# Altium schematic sheet CAMERA_INTERFACE.SchDoc
size C; SheetNumber: 3; SheetTotal: 9
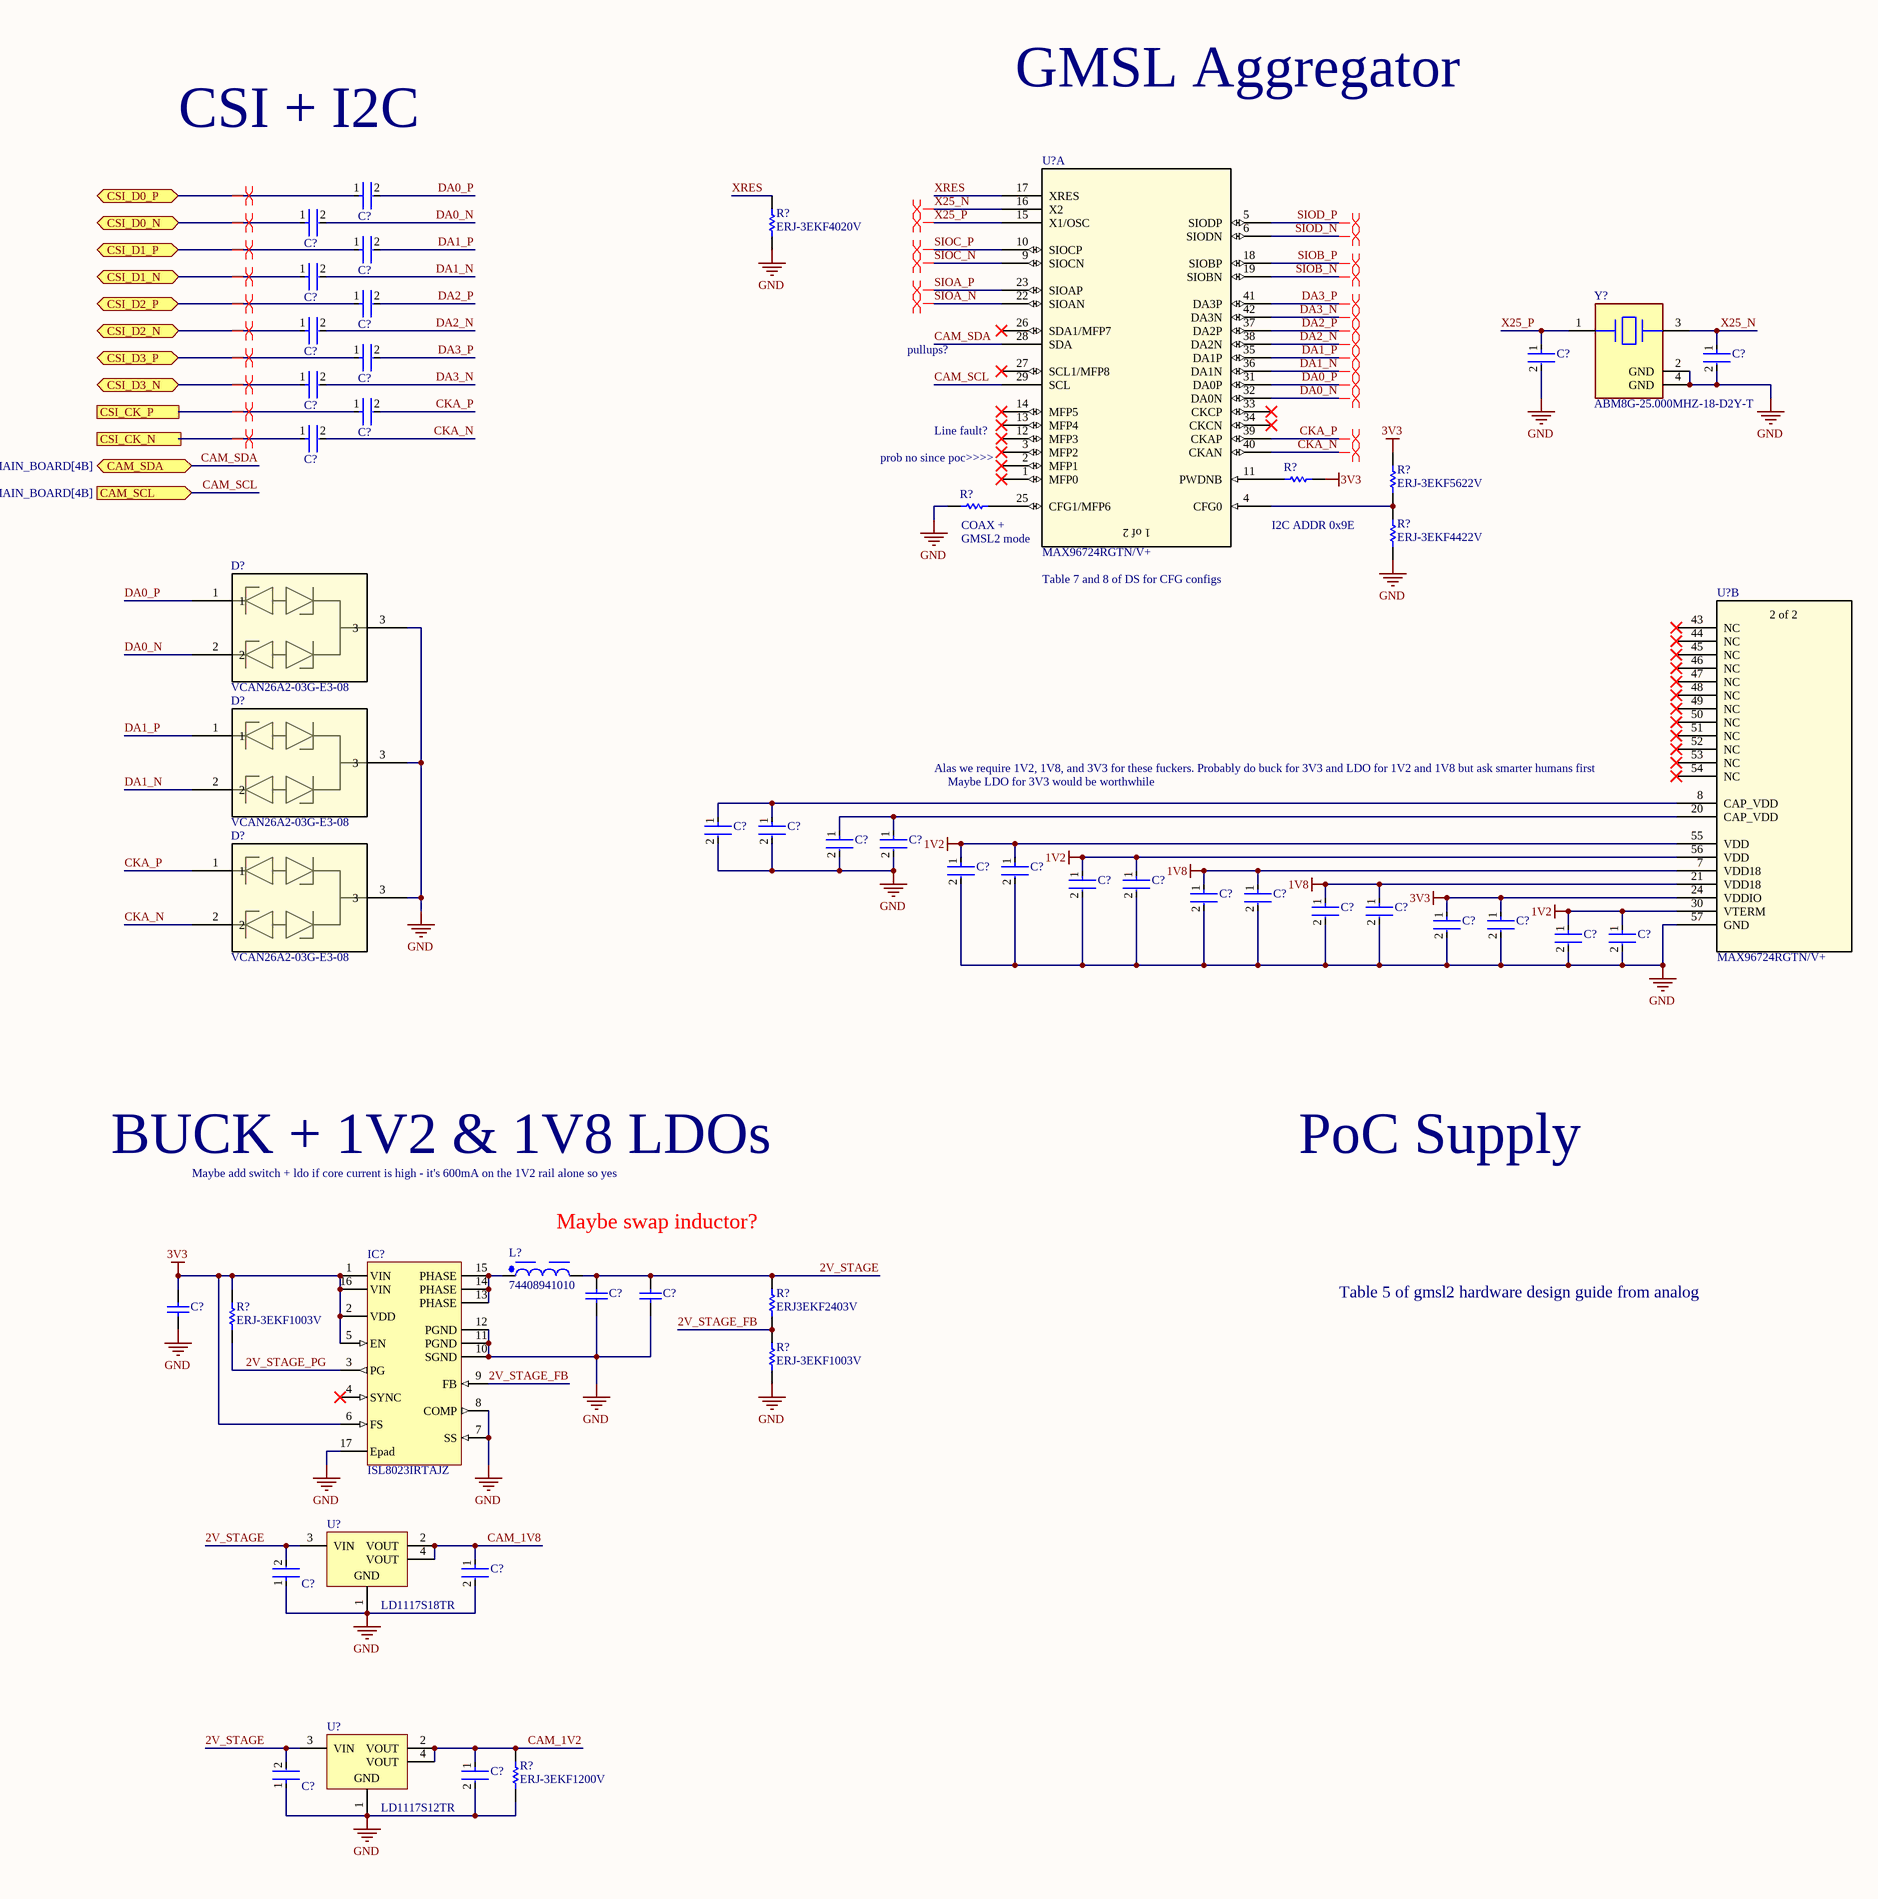
[diagram p0: CAMERA_INTERFACE.SchDoc, left]
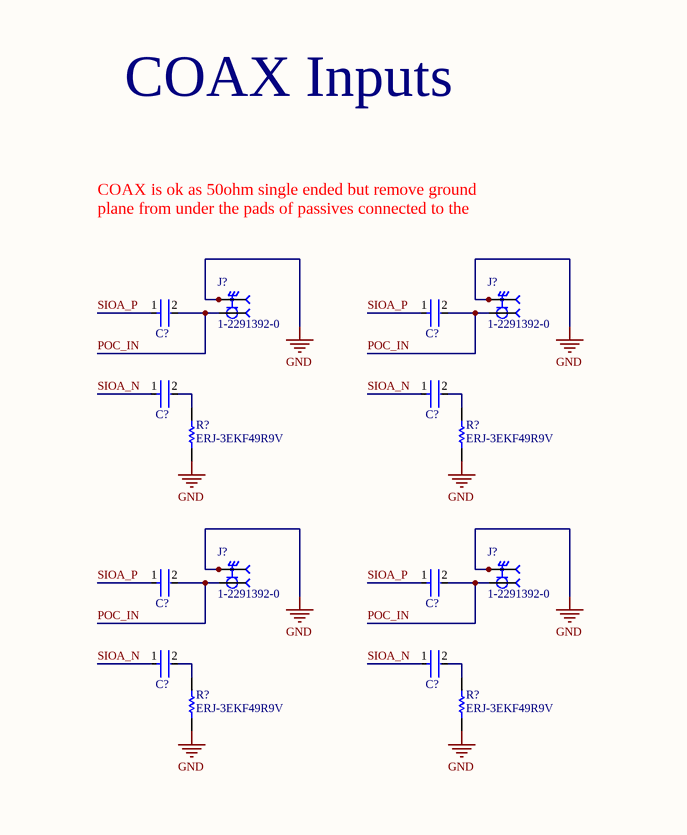
[diagram p1: CAMERA_INTERFACE.SchDoc, middle]

## Parts
(Parts that share a designator on the sheet are numbered #1, #2 ... from top to bottom, then left to right.)
C?#1  C1005X7R1H104K050BB  [FP-C1005-050-0_05-IPC_C]  (value not drawn)
C?#2  C1005X7R1H104K050BB  [FP-C1005-050-0_05-IPC_C]  (value not drawn)
C?#3  C1005X7R1H104K050BB  [FP-C1005-050-0_05-IPC_C]  (value not drawn)
C?#4  C1005X7R1H104K050BB  [FP-C1005-050-0_05-IPC_C]  (value not drawn)
C?#5  C1005X7R1H104K050BB  [FP-C1005-050-0_05-IPC_C]  (value not drawn)
C?#6  C1005X7R1H104K050BB  [FP-C1005-050-0_05-IPC_C]  (value not drawn)
C?#7  C1005X7R1H104K050BB  [FP-C1005-050-0_05-IPC_C]  (value not drawn)
C?#8  C1005X7R1H104K050BB  [FP-C1005-050-0_05-IPC_C]  (value not drawn)
C?#9  C0603C300J5GACTU  [FP-C0603C-CF-MFG]  (value not drawn)
C?#10  C0603C300J5GACTU  [FP-C0603C-CF-MFG]  (value not drawn)
C?#11  C1005X7R1H104K050BB  [FP-C1005-050-0_05-IPC_C]  (value not drawn)
C?#12  C1005X7R1H104K050BB  [FP-C1005-050-0_05-IPC_C]  (value not drawn)
C?#13  C1005X7R1H104K050BB  [FP-C1005-050-0_05-IPC_C]  (value not drawn)
C?#14  C1005X7R1H104K050BB  [FP-C1005-050-0_05-IPC_C]  (value not drawn)
C?#15  C1005X7R1H104K050BB  [FP-C1005-050-0_05-IPC_C]  (value not drawn)
C?#16  C1005X7R1H104K050BB  [FP-C1005-050-0_05-IPC_C]  (value not drawn)
C?#17  C1005X7R1H104K050BB  [FP-C1005-050-0_05-IPC_C]  (value not drawn)
C?#18  C1005X7R1H104K050BB  [FP-C1005-050-0_05-IPC_C]  (value not drawn)
C?#19  C1005X7R1H104K050BB  [FP-C1005-050-0_05-IPC_C]  (value not drawn)
C?#20  C1005X7R1H104K050BB  [FP-C1005-050-0_05-IPC_C]  (value not drawn)
C?#21  GRM188R60J106ME47D  [FP-GRM188-0_1-e0_2_0_55-IPC_A]  (value not drawn)
C?#22  CC0603KRX7R8BB103  [FP-CC0603-DA-MFG]  (value not drawn)
C?#23  GRM188R60J106ME47D  [FP-GRM188-0_1-e0_2_0_55-IPC_A]  (value not drawn)
C?#24  CC0603KRX7R8BB103  [FP-CC0603-DA-MFG]  (value not drawn)
C?#25  GRM188R60J106ME47D  [FP-GRM188-0_1-e0_2_0_55-IPC_A]  (value not drawn)
C?#26  CC0603KRX7R8BB103  [FP-CC0603-DA-MFG]  (value not drawn)
C?#27  GRM188R60J106ME47D  [FP-GRM188-0_1-e0_2_0_55-IPC_A]  (value not drawn)
C?#28  CC0603KRX7R8BB103  [FP-CC0603-DA-MFG]  (value not drawn)
C?#29  GRM188R60J106ME47D  [FP-GRM188-0_1-e0_2_0_55-IPC_A]  (value not drawn)
C?#30  CC0603KRX7R8BB103  [FP-CC0603-DA-MFG]  (value not drawn)
C?#31  GRM188R60J106ME47D  [FP-GRM188-0_1-e0_2_0_55-IPC_A]  (value not drawn)
C?#32  CC0603KRX7R8BB103  [FP-CC0603-DA-MFG]  (value not drawn)
C?#33  GRM188R60J106ME47D  [FP-GRM188-0_1-e0_2_0_55-IPC_A]  (value not drawn)
C?#34  CC0603KRX7R8BB103  [FP-CC0603-DA-MFG]  (value not drawn)
C?#35  GRM188R60J106ME47D  [FP-GRM188-0_1-e0_2_0_55-IPC_A]  (value not drawn)
C?#36  CC0603KRX7R8BB103  [FP-CC0603-DA-MFG]  (value not drawn)
C?#37  C1608X5R0J226M080AC  [CAPC1608X100X20ML10]  (value not drawn)
C?#38  C1608X5R0J226M080AC  [CAPC1608X100X20ML10]  (value not drawn)
C?#39  C1608X5R0J226M080AC  [CAPC1608X100X20ML10]  (value not drawn)
C?#40  GRM188R60J106ME47D  [FP-GRM188-0_1-e0_2_0_55-IPC_A]  (value not drawn)
C?#41  C1005X7R1H104K050BB  [FP-C1005-050-0_05-IPC_C]  (value not drawn)
C?#42  GRM188R60J106ME47D  [FP-GRM188-0_1-e0_2_0_55-IPC_A]  (value not drawn)
C?#43  C1005X7R1H104K050BB  [FP-C1005-050-0_05-IPC_C]  (value not drawn)
D?#1  VCAN26A2-03G-E3-08  [VCAN26A2-03G-E3-08-Footprint-1]
D?#2  VCAN26A2-03G-E3-08  [VCAN26A2-03G-E3-08-Footprint-1]
D?#3  VCAN26A2-03G-E3-08  [VCAN26A2-03G-E3-08-Footprint-1]
IC?  ISL8023IRTAJZ  [TQFN50P300X300X80_HS-17N]
J?#1  1-2291392-0  [1-2291392-0-Footprint-1]
J?#2  1-2291392-0  [1-2291392-0-Footprint-1]
J?#3  1-2291392-0  [1-2291392-0-Footprint-1]
J?#4  1-2291392-0  [1-2291392-0-Footprint-1]
L?  74408941010  [WE-SPC_4818]
R?#1  ERJ-3EKF4020V  [RESC1608X55X30LL15T15]
R?#2  ERJ-3EKF49R9V  [RESC1608X55X30ML15T15]
R?#3  ERJ-3EKF49R9V  [RESC1608X55X30ML15T15]
R?#4  ERJ3EKF1002V  [RESC1609X55X30LL15T15]  (value not drawn)
R?#5  ERJ-3EKF5622V  [RESC1608X55X30LL15T15]
R?#6  ERJ3EKF1002V  [RESC1609X55X30LL15T15]  (value not drawn)
R?#7  ERJ-3EKF4422V  [RESC1608X55X30ML15T15]
R?#8  ERJ-3EKF49R9V  [RESC1608X55X30ML15T15]
R?#9  ERJ-3EKF49R9V  [RESC1608X55X30ML15T15]
R?#10  ERJ3EKF2403V  [RESC1608X55X30NL15T15]
R?#11  ERJ-3EKF1003V  [RESC1608X55X30ML15T15]
R?#12  ERJ-3EKF1003V  [RESC1608X55X30ML15T15]
R?#13  ERJ-3EKF1200V  [RESC1609X55X30ML15T15]
U?#1  MAX96724RGTN/V+  [QFN50P800X800X80_HS-57N]  (part A of 2)
U?#2  MAX96724RGTN/V+  [QFN50P800X800X80_HS-57N]  (part B of 2)
U?#3  LD1117S18TR  [SOT-223_M]
U?#4  LD1117S12TR  [SOT-223_M]
Y?  ABM8G-25.000MHZ-18-D2Y-T  [FP-ABM8G-MFG]

## Ports
CAM_SCL (in, see MAIN_BOARD[4B]), CAM_SDA (bidir, see MAIN_BOARD[4B]), CSI_CK_N (in), CSI_CK_P (in), CSI_D0_N (bidir), CSI_D0_P (bidir), CSI_D1_N (bidir), CSI_D1_P (bidir), CSI_D2_N (bidir), CSI_D2_P (bidir), CSI_D3_N (bidir), CSI_D3_P (bidir)

## Nets
1V2: C?#25.1 C?#26.1 C?#27.1 C?#28.1 C?#35.1 C?#36.1 U?#2.30(VTERM) U?#2.55(VDD) U?#2.56(VDD)
1V8: C?#29.1 C?#30.1 C?#31.1 C?#32.1 U?#2.7(VDD18) U?#2.21(VDD18)
3V3: C?#33.1 C?#34.1 C?#39.2 IC?.1(VIN) IC?.2(VDD) IC?.5(EN) IC?.6(FS) IC?.16(VIN) R?#4.2 R?#5.2 R?#11.2 U?#2.24(VDDIO)
GND: C?#9.2 C?#10.2 C?#21.2 C?#22.2 C?#23.2 C?#24.2 C?#25.2 C?#26.2 C?#27.2 C?#28.2 C?#29.2 C?#30.2 C?#31.2 C?#32.2 C?#33.2 C?#34.2 C?#35.2 C?#36.2 C?#37.1 C?#38.1 C?#39.1 C?#40.2 C?#41.1 C?#42.2 C?#43.1 D?#1.3 D?#2.3 D?#3.3 IC?.7(SS) IC?.8(COMP) IC?.10(SGND) IC?.11(PGND) IC?.12(PGND) IC?.17(Epad) J?#1.S1 J?#1.S2 J?#1.S3 J?#1.S4 J?#2.S1 J?#2.S2 J?#2.S3 J?#2.S4 J?#3.S1 J?#3.S2 J?#3.S3 J?#3.S4 J?#4.S1 J?#4.S2 J?#4.S3 J?#4.S4 R?#1.1 R?#2.1 R?#3.1 R?#6.1 R?#7.1 R?#8.1 R?#9.1 R?#12.1 R?#13.1 U?#2.57(GND) U?#3.1(GND) U?#4.1(GND) Y?.2(GND) Y?.4(GND)
2V_STAGE: C?#37.2 C?#38.2 C?#41.2 C?#43.2 L?.2 R?#10.2 U?#3.3(VIN) U?#4.3(VIN)
2V_STAGE_FB: IC?.9(FB) R?#10.1 R?#12.2
2V_STAGE_PG: IC?.3(PG) R?#11.1
CAM_1V2: C?#42.1 R?#13.2 U?#4.2(VOUT) U?#4.4(VOUT)
CAM_1V8: C?#40.1 U?#3.2(VOUT) U?#3.4(VOUT)
CAM_SCL: U?#1.29(SCL) ; port CAM_SCL
CAM_SDA: U?#1.28(SDA) ; port CAM_SDA
CKA_N: C?#16.2 D?#3.2 U?#1.40(CKAN)
CKA_P: C?#13.2 D?#3.1 U?#1.39(CKAP)
CSI_CK_N: C?#16.1 ; port CSI_CK_N
CSI_CK_P: C?#13.1 ; port CSI_CK_P
CSI_D0_N: C?#2.1 ; port CSI_D0_N
CSI_D0_P: C?#1.1 ; port CSI_D0_P
CSI_D1_N: C?#4.1 ; port CSI_D1_N
CSI_D1_P: C?#3.1 ; port CSI_D1_P
CSI_D2_N: C?#6.1 ; port CSI_D2_N
CSI_D2_P: C?#5.1 ; port CSI_D2_P
CSI_D3_N: C?#12.1 ; port CSI_D3_N
CSI_D3_P: C?#11.1 ; port CSI_D3_P
DA0_N: C?#2.2 D?#1.2 U?#1.32(DA0N)
DA0_P: C?#1.2 D?#1.1 U?#1.31(DA0P)
DA1_N: C?#4.2 D?#2.2 U?#1.36(DA1N)
DA1_P: C?#3.2 D?#2.1 U?#1.35(DA1P)
DA2_N: C?#6.2 U?#1.38(DA2N)
DA2_P: C?#5.2 U?#1.37(DA2P)
DA3_N: C?#12.2 U?#1.42(DA3N)
DA3_P: C?#11.2 U?#1.41(DA3P)
POC_IN: C?#7.2 C?#8.2 C?#17.2 C?#18.2 J?#1.1 J?#2.1 J?#3.1 J?#4.1
SIOA_N: C?#14.1 C?#15.1 C?#19.1 C?#20.1 U?#1.22(SIOAN)
SIOA_P: C?#7.1 C?#8.1 C?#17.1 C?#18.1 U?#1.23(SIOAP)
SIOB_N: U?#1.19(SIOBN)
SIOB_P: U?#1.18(SIOBP)
SIOC_N: U?#1.9(SIOCN)
SIOC_P: U?#1.10(SIOCP)
SIOD_N: U?#1.6(SIODN)
SIOD_P: U?#1.5(SIODP)
X25_N: C?#10.1 U?#1.16(X2) Y?.3
X25_P: C?#9.1 U?#1.15(X1/OSC) Y?.1
XRES: R?#1.2 U?#1.17(XRES)
NetC?#14_2: C?#14.2 R?#2.2
NetC?#15_2: C?#15.2 R?#3.2
NetC?#19_2: C?#19.2 R?#8.2
NetC?#20_2: C?#20.2 R?#9.2
NetC?#21_1: C?#21.1 C?#22.1 U?#2.8(CAP_VDD)
NetC?#23_1: C?#23.1 C?#24.1 U?#2.20(CAP_VDD)
NetIC?_13: IC?.13(PHASE) IC?.14(PHASE) IC?.15(PHASE) L?.1
NetR?#4_1: R?#4.1 U?#1.11(PWDNB)
NetR?#5_1: R?#5.1 R?#7.2 U?#1.4(CFG0)
NetR?#6_2: R?#6.2 U?#1.25(CFG1/MFP6)

Not connected (* = marked no-connect by the designer): IC? 4(SYNC)*; U?#1 1(MFP0)* 2(MFP1)* 3(MFP2)* 12(MFP3)* 13(MFP4)* 14(MFP5)* 26(SDA1/MFP7)* 27(SCL1/MFP8)* 33(CKCP)* 34(CKCN)*; U?#2 43(NC)* 44(NC)* 45(NC)* 46(NC)* 47(NC)* 48(NC)* 49(NC)* 50(NC)* 51(NC)* 52(NC)* 53(NC)* 54(NC)*

## Layout directives
differential pair: CKA_N, CKA_P, CSI_CK_N, CSI_CK_P, CSI_D0_N, CSI_D0_P, CSI_D1_N, CSI_D1_P, CSI_D2_N, CSI_D2_P, CSI_D3_N, CSI_D3_P, DA0_N, DA0_P, DA1_N, DA1_P, DA2_N, DA2_P, DA3_N, DA3_P, SIOA_N, SIOA_P, SIOB_N, SIOB_P, SIOC_N, SIOC_P, SIOD_N, SIOD_P, X25_N, X25_P

## Notes on the sheet
- CSI + I2C
- GMSL Aggregator
- COAX Inputs
- COAX is ok as 50ohm single ended but remove ground plane from under the pads of passives connected to the GMSL trace
- pullups?
- prob no since poc>>>>
- (near U?#1) Line fault?
- GMSL2 mode
- (near R?#6) COAX +
- (near R?#4) I2C ADDR 0x9E
- Table 7 and 8 of DS for CFG configs
- (near U?#2) Alas we require 1V2, 1V8, and 3V3 for these fuckers. Probably do buck for 3V3 and LDO for 1V2 and 1V8 but ask smarter humans first
- Maybe LDO for 3V3 would be worthwhile
- BUCK + 1V2 & 1V8 LDOs
- PoC Supply
- Maybe add switch + ldo if core current is high - it's 600mA on the 1V2 rail alone so yes
- Maybe swap inductor?
- Table 5 of gmsl2 hardware design guide from analog
- (in symbol CMP-015-00011-2, part A) 1 of 2
- (in symbol CMP-015-00011-2, part B) 2 of 2

## Library data of the parts
C?#1-C?#8 C?#11-C?#20 C?#41 C?#43 = CMP-2000-05393-2: Multilayer Ceramic Capacitors 100nF ±10% 50V X7R SMD 0402; Voltage: 50V; Dielectric Material: Ceramic; Min Operating Temperature: -55°C; Depth: 0.5mm; Radiation Hardening: No; RoHS Compliant: Yes; Voltage Rating (DC): 50V; Lead Free: Lead Free; Resistor Type: Ceramic; Height: 0.5mm; Dielectric: X7R; Thickness: 0.022inch; Case/Package: 0402; Case Code (Metric): 1005; Termination: SMD/SMT; Capacitance: 100nF; Packaging: Tape and Reel; Max Operating Temperature: 125°C; Mount: Surface Mount; Package Quantity: 1; Width: 0.02inch; Weight: 2.3E-05oz; Voltage Rating: 50V; Tolerance: 10%; Construction: Flat; Case Code (Imperial): 0402; Length: 1mm; REACH SVHC: No SVHC; Series: C
C?#9 C?#10 = CMP-1035-00914-3: CAP CER 30PF 50V 5% NP0 0603; Manufacturer: KEMET; Automotive Grade: Grade 1; Temperature Coefficient: 30ppm/°C; Material: Ceramic; Temperature Characteristic: C0G; Tolerance: 0.05; Manufacturer Part Number: C0603C300J5GACTU; ComponentLink2URL: https://api.kemet.com/component-edge/download/datasheet/C0603C100J5GACAUTO.pdf; Automotive: Yes; Device Class L2: Capacitors; Device Class L1: Passive Components; Device Class L3: Ceramic Capacitors; RoHS: TRUE; Octopart: https://octopart.com/c0603c300j5gactu-kemet-199455; Lead Free: Yes; Value: 30 pF; Temperature Range High: +125°C; Category: Cap; Temperature: -55°C to +125°C; Package: C0603C-CF; Capacitance: 30 pF; Digikey Description: CAP CER 30PF 50V 5% NP0 0603; Height: 0.87mm; ComponentLink2Description: Datasheet; Temperature Range Low: -55°C; Mouser Description: Multilayer Ceramic Capacitors MLCC - SMD/SMT 50volts 30pF C0G 5%; Voltage Rating: 50 V
C?#21 C?#23 C?#25 C?#27 C?#29 C?#31 C?#33 C?#35 C?#40 C?#42 = CMP-2006-02792-2: Chip Multilayer Ceramic Capacitors for General Purpose, 0603, 10uF, X5R, 15%, 20%, 6.3V; Packaging: Tape and Reel; Voltage Rating (DC): 6.3V; Width: 0.031inch; Termination: SMD/SMT; Dielectric: X5R; Package Quantity: 4000; Voltage Rating: 6.3V; Capacitance: 10uF; Case/Package: 0603; Min Operating Temperature: -55°C; Voltage: 6.3V; Length: 1.6mm; Thickness: 0.035inch; Lead Free: Lead Free; Depth: 0.8mm; Case Code (Imperial): 0603; Max Operating Temperature: 85°C; Material: Ceramic; Height: 0.8mm; Tolerance: 20%; Mount: Surface Mount; REACH SVHC: No SVHC; Radiation Hardening: No; Case Code (Metric): 1608
C?#22 C?#24 C?#26 C?#28 C?#30 C?#32 C?#34 C?#36 = CMP-03422-000327-1: CAP CER 10000PF 25V X7R 0603; Manufacturer: YAGEO; Tolerance: 0.1; Value: 10 nF; Temperature Coefficient: 15%; Material: Ceramic; Lead Free: Yes; Temperature Range Low: -55°C; Mouser Description: Multilayer Ceramic Capacitors MLCC - SMD/SMT 10nF 25V X7R 10%; Device Class L1: Passive Components; RoHS: TRUE; Digikey Description: CAP CER 10000PF 25V X7R 0603; Capacitance: 10 nF; Temperature: -55°C to +125°C; Footprint Url: http://www.yageo.com/exep/pages/download/literatures/UPY-C_GEN_24.pdf; Category: Cap; ComponentLink2URL: http://www.yageo.com/documents/recent/UPY-GPHC_X7R_6.3V-to-50V_18.pdf; Octopart: https://octopart.com/cc0603krx7r8bb103-yageo-9288195; Temperature Characteristic: X7R; ComponentLink2Description: Datasheet; Voltage Rating: 25 V; Package: CC0603-DA; Automotive: No; Voltage: 25 V; Device Class L3: Ceramic Capacitors; Manufacturer Part Number: CC0603KRX7R8BB103; Device Class L2: Capacitors; Temperature Range High: +125°C; Height: 0.9mm
C?#37-C?#39 = CMP-2000-05440-1: Chip Capacitor, 22 uF, +/- 20%, 6.3 V, -55 to 85 degC, 1608 (0603 Metric), RoHS, Tape and Reel; PCN Part Number: MLCCPartNumberChange30/Nov/2012; Manufacturer: TDK; Temperature Coefficient: X5R; Product Training Modules: CSeriesGeneralApplicationsSEAT,CCV,andTVCLDesignToolsGuidetoReplacinganElectrolyticCapacitorwithanMLCC; Other Names: 445-8028-1; Capacitance: 22µF; Voltage - Rated: 6.3V; Design Resources: 20WNon-IsolatedBuckLEDDriverUsingPLLNK460KG; Online Catalog: CSeries,GeneralPurpose; Kits: 445-9003-KIT-ND-KITCAPCERHICAPMLCCSMD; Tolerance: ±20%; Series: C; Thickness (Max): 0.039"(1.00mm); Mounting Type: SurfaceMount,MLCC; Ratings: -; Datasheet Version: Mar-15; Package Reference: 603; Packaging: CutTape(CT); Features: -; Package / Case: 0603(1608Metric); Family: CeramicCapacitors; Lead Spacing: -; RoHS Information: RoHSCertificate-MLCC; Manufacturer URL: http://www.tdk.com/; Lead Style: -; Category: Capacitors; Applications: GeneralPurpose; Package Description: 2-Pin Surface Mount Device, Body 1.6 x 0.8 mm; Standard Package: 1; Datasheet URL: http://www.farnell.com/datasheets/1913358.pdf; Height - Seated (Max): -; Operating Temperature: -55degC~85degC; Size / Dimension: 0.063"Lx0.031"W(1.60mmx0.80mm)
D?#1-D?#3 = CMP-004-00042-1: ESD Suppressor Diode TVS Bi-Dir 26.5V 3-Pin SOT-323 T/R
IC? = CMP-00572-88252977-1: ISL8023IRTAJZ Conv DC-DC Single Step Down 2.7V to 5.5V 16-Pin QFN EP; Output Current: 3A; NexarPartId: 88252977; Output Voltage: 5.5V
J?#1-J?#4 = CMP-002-00082-1: Male Asm, 1 Pos, R/a, Pcb, Fakra
L? = CMP-1401-00006-2: NexarPartId: 23392449; Current Rating: 3A; DC Resistance (DCR): 25mΩ; Inductance: 1µH; Core Material: Ferrite; Self Resonant Frequency: 100MHz; Inductance Tolerance: 20%; Number of Pins: 2; Length: 4.8mm; Width: 4.8mm; Min Operating Temperature: -40°C; Packaging: Tape & Reel (TR); RoHS: Compliant; Height: 1.8mm; Ambient Temperature Range High: 85°C; Max Operating Temperature: 125°C; Ambient Temperature Range Low: -40°C
R?#1 = CMP-2000-00484-1: Manufacturer: Panasonic; Part Number: ERJ-3EKF4020V
R?#2 R?#3 R?#8 R?#9 = CMP-2000-00538-1: Manufacturer: Panasonic; Part Number: ERJ-3EKF49R9V
R?#4 R?#6 = CMP-1012-00623-3: Chip Resistor, 10 KOhm, +/- 1%, 0.1 W, -55 to 155 degC, 0603 (1608 Metric), RoHS, Tape and Reel; Manufacturer: Panasonic; Voltage Rating: 75V; Case\/Package: 0603; Power Rating: 100mW; Resistance: 10KOhm; Temperature Coefficient: 100ppm\/degreesC; Number of Pins: 2; Package Reference: 603; Depth: 0.8mm; Mount: SurfaceMount; Package Description: 2-Pin Surface Mount Device, Body 1.6 x 0.85 mm; Datasheet Version: 02/2017; Length: 1.6mm; Lead Free: LeadFree; Height: 0.45mm; Number of Terminations: 2; Max Power Dissipation: 100mW; Min Operating Temperature: -55degC; Datasheet URL: https://industrial.panasonic.com/cdbs/www-data/pdf/RDA0000/AOA0000C304.pdf; Termination: SMD/SMT; Case Code (Metric): 1608; Case Code (Imperial): 0603; Tolerance: 1%; Max Operating Temperature: 155degC; RoHSCompliant: true; Voltage Rating (DC): 75V; Radiation Hardening: No; Packaging: TapeandReel; Composition: ThickFilm; Mounting Technology: SurfaceMount; Manufacturer URL: http://www.panasonic.com/; Width: 0.031inch; REACH SVHC: NoSVHC; Contact Plating: Tin; Military Standard: Not; Package Quantity: 1
R?#5 = CMP-2000-00570-1: Manufacturer: Panasonic; Part Number: ERJ-3EKF5622V
R?#7 = CMP-2000-00508-1: Manufacturer: Panasonic; Part Number: ERJ-3EKF4422V
R?#10 = CMP-2000-00363-1: Manufacturer: Panasonic; Part Number: ERJ3EKF2403V
R?#11 R?#12 = CMP-2000-00182-1: Manufacturer: Panasonic; Part Number: ERJ-3EKF1003V
R?#13 = CMP-2000-00213-2: Chip Resistor, 120 Ohm, +/- 1%, 0.1 W, -55 to 155 degC, 0603 (1608 Metric), RoHS, Tape and Reel; Manufacturer: Panasonic; Power Rating: 100mW; Voltage Rating (DC): 75V; Resistance: 120Ohm; Temperature Coefficient: 100ppm/degreesC; Number of Terminations: 2; Military Standard: Not; Tolerance: 1%; Min Operating Temperature: -55degC; Packaging: TapeandReel; Lead Free: LeadFree; Max Operating Temperature: 155degC; Manufacturer URL: http://www.panasonic.com/; Case Code (Imperial): 0603; REACH SVHC: NoSVHC; Width: 0.031inch; Datasheet URL: https://industrial.panasonic.com/cdbs/www-data/pdf/RDA0000/AOA0000C283.pdf; RoHSCompliant: true; Max Power Dissipation: 100mW; Termination: SMD/SMT; Package Reference: 0603; Height: 0.022inch; Depth: 0.8mm; Package Description: 2-Pin Surface Mount Device, Body 1.6 x 0.85 mm; Contact Plating: Tin; Length: 1.6mm; Package URL: http://www.st.com/st-web-ui/static/active/en/resource/technical/document/datasheet/CD00001320.pdf; Radiation Hardening: No; Package Quantity: 1; Number of Pins: 2; Datasheet Version: 42095.0; Voltage Rating: 75V; Composition: ThickFilm; Case/Package: 0603; Mount: SurfaceMount; Case Code (Metric): 1608
U?#1 U?#2 = CMP-015-00011-2: Quad Tunneling GMSL2/1 to CSI-2 Deserializer
U?#3 = CMP-0244-00308-1: Fixed Low Drop Positive Voltage Regulator, 1.8V, 4-Pin SOT-223, Tape and Reel; ComponentLink1URL: http://www.st.com; PackageReference: SOT-223; PackageDescription: 4-Pin SOT-223 Package, 6.5 x 3.5 mm Body, 2.3 mm Pitch, 7 mm Lead Span; ComponentLink2URL: http://www.st.com/internet/com/TECHNICAL_RESOURCES/TECHNICAL_LITERATURE/DATASHEET/CD00000544.pdf; ComponentLink2Description: Datasheet; ComponentLink1Description: Manufacturer URL; DatasheetVersion: 1/11/2011; PackageVersion: 2010
U?#4 = CMP-0244-00318-1: Fixed Low Drop Positive Voltage Regulator, 1.2V, 4-Pin SOT-223, Tape and Reel; PackageDescription: 4-Pin SOT-223 Package, 6.5 x 3.5 mm Body, 2.3 mm Pitch, 7 mm Lead Span; PackageVersion: 2010; ComponentLink2Description: Datasheet; PackageReference: SOT-223; ComponentLink2URL: http://www.st.com/internet/com/TECHNICAL_RESOURCES/TECHNICAL_LITERATURE/DATASHEET/CD00000544.pdf; ComponentLink1Description: Manufacturer URL; DatasheetVersion: 1/11/2011; ComponentLink1URL: http://www.st.com
Y? = CMP-2000-05733-3: Crystal 25MHz ±20ppm (Tol) ±30ppm (Stability) 18pF FUND 60Ω 4-Pin SMD T/R; Series Resistance: 60R; Length: 3.2mm; Depth: 2.5mm; Packaging: Tape and Reel; Min Operating Temperature: -40°C; Operating Frequency: 25 MHz; Lead Free: Lead Free; Number of Pins: 4; Frequency Tolerance: 20ppm; Radiation Hardening: No; Max Operating Temperature: 85°C; Termination: SMD/SMT; Frequency Stability: 30ppm; Frequency: 25MHz; Series: ABM8G; Mount: Surface Mount; Package Quantity: 1000; Height: 0.039inch; Width: 0.098inch; Case/Package: CSMD; ESR (Equivalent Series Resistance): 60R; Load Capacitance: 18pF; Tolerance: 20ppm